# Altium schematic sheet Main.SchDoc
size A4; SheetNumber: 1; SheetTotal: 6
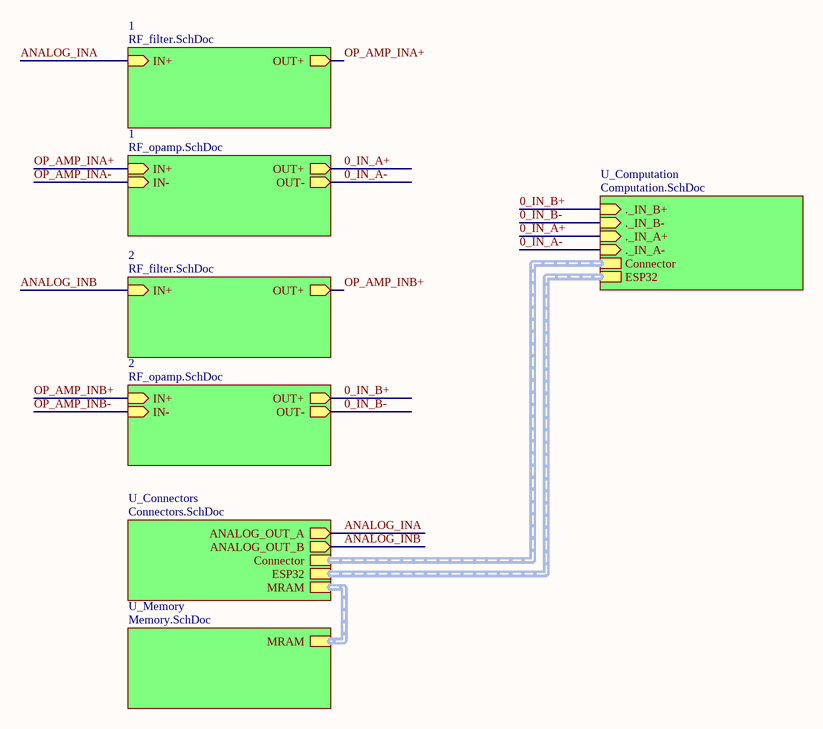
[diagram p0: Main.SchDoc]

## Sub-sheets
1 = RF_filter.SchDoc: IN+ (in), OUT+ (out)
1 = RF_opamp.SchDoc: IN+ (in), OUT+ (out), IN- (in), OUT- (out)
2 = RF_filter.SchDoc: IN+ (in), OUT+ (out)
2 = RF_opamp.SchDoc: IN+ (in), OUT+ (out), IN- (in), OUT- (out)
U_Computation = Computation.SchDoc: ._IN_B+ (in), ._IN_B- (in), ._IN_A+ (in), ._IN_A- (in), Connector (harness Connector), ESP32 (harness *)
U_Connectors = Connectors.SchDoc: ANALOG_OUT_A (out), ANALOG_OUT_B (out), Connector (harness Connector), MRAM (harness MRAM), ESP32 (harness *)
U_Memory = Memory.SchDoc: MRAM (harness MRAM)

## Nets
0_IN_A+: sheet 1/OUT+, sheet U_Computation/._IN_A+
0_IN_A-: sheet 1/OUT-, sheet U_Computation/._IN_A-
0_IN_B+: sheet 2/OUT+, sheet U_Computation/._IN_B+
0_IN_B-: sheet 2/OUT-, sheet U_Computation/._IN_B-
ANALOG_INA: sheet 1/IN+, sheet U_Connectors/ANALOG_OUT_A
ANALOG_INB: sheet 2/IN+, sheet U_Connectors/ANALOG_OUT_B
OP_AMP_INA+: sheet 1/OUT+, sheet 1/IN+
OP_AMP_INA-: sheet 1/IN-
OP_AMP_INB+: sheet 2/OUT+, sheet 2/IN+
OP_AMP_INB-: sheet 2/IN-

## Buses and harness runs
harness sheet U_Computation/Connector = sheet U_Connectors/Connector
harness sheet U_Computation/ESP32 = sheet U_Connectors/ESP32
harness sheet U_Connectors/MRAM = sheet U_Memory/MRAM